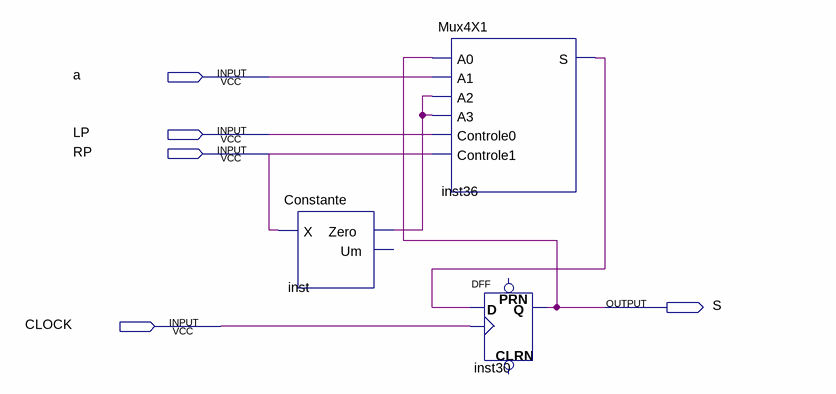
[diagram p0: schematic sheet]
// Quartus schematic Registrador1B2C.bdf as structural Verilog: 3 symbols, 5 pins
module Registrador1B2C (
  input  a,
  input  LP,
  input  RP,
  input  CLOCK,
  output S
);

  wire inst36_s, inst_zero;

  Constante inst (.X(RP), .Zero(inst_zero));  // open: Um
  Mux4X1 inst36 (.A0(S), .A1(a), .A2(inst_zero), .A3(inst_zero), .Controle0(LP), .Controle1(RP), .S(inst36_s));
  DFF inst30 (.CLK(CLOCK), .D(inst36_s), .Q(S));  // open: CLRN, PRN
endmodule
